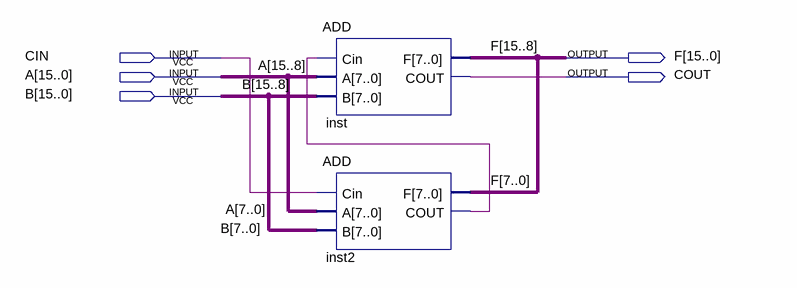
[diagram p0: schematic sheet]
// Quartus schematic ADD_16BIT.bdf as structural Verilog: 2 symbols, 5 pins
module ADD_16BIT (
  input  CIN,
  input  [15:0] A,
  input  [15:0] B,
  output [15:0] F,
  output COUT
);

  wire inst2_cout;

  ADD inst (.Cin(inst2_cout), .A(A[15:8]), .B(B[15:8]), .F(F[15:8]), .COUT(COUT));
  ADD inst2 (.Cin(CIN), .A(A[7:0]), .B(B[7:0]), .F(F[7:0]), .COUT(inst2_cout));
endmodule
